# Altium schematic sheet XH-2A_C29086001_XH-2A_C2908600.schdoc.schdoc
size 124 x 99 mm
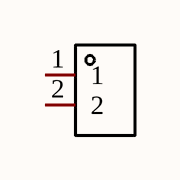
[diagram p0: XH-2A_C29086001_XH-2A_C2908600.schdoc.schdoc]

## Parts
CN?  XH-2A  [CONN-TH_2P-P2.50_HCTL_XH-2A-X]  (value not drawn)

## Nets

Not connected (* = marked no-connect by the designer): CN? 1 2

## Library data of the parts
CN? = XH-2A: Manufacturer: HCTL(华灿天禄); Symbol: XH-2A_C2908600; Add into BOM: yes; Pins Structure: 1x2P; Pitch: 2.5mm; Number of PINs Per Row: 2; Reference Series: XH; Current Rating (Max): 3A; Device: XH-2A; Supplier: LCSC; Supplier Part: C2908600; Manufacturer Part: XH-2A; JLCPCB Part Class: Extended Part; LCSC Part Name: 1x2P 间距:2.5mm 直插 系列:XH; Supplier Footprint: 插件,P=2.5mm; Datasheet: https://atta.szlcsc.com/upload/public/pdf/source/20230711/68D365716984B4AFE576D1D73D61B465.pdf; Convert to PCB: yes; Mounting Style: 直插; Row Spacing: -; Number of Pins: 2P; Number of Rows: 1; Operating Temperature Range: -25℃~+85℃